# EAGLE design AnalogDiscoveryJacks (EAGLE 9.6.1)
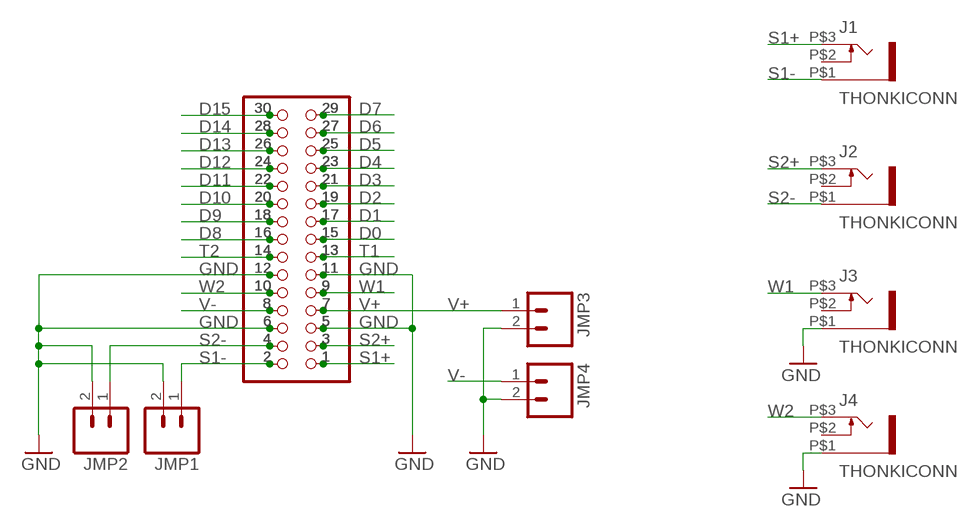
[diagram p0: schematic, sheet 1]

## Parts
J1  THONKICONN  [THONKICONN]
J2  THONKICONN  [THONKICONN]
J3  THONKICONN  [THONKICONN]
J4  THONKICONN  [THONKICONN]
JMP1  M02PTH  [1X02]
JMP2  M02PTH  [1X02]
JMP3  M02PTH  [1X02]
JMP4  M02PTH  [1X02]
JP1  PINHD-2X15  [2X15]
JP2  PINHD-2X15  [2X15]
JP3  PINHD-2X15  [2X15]

## Nets
D0: JP1.15 JP2.15 JP3.15
D1: JP1.17 JP2.17 JP3.17
D2: JP1.19 JP2.19 JP3.19
D3: JP1.21 JP2.21 JP3.21
D4: JP1.23 JP2.23 JP3.23
D5: JP1.25 JP2.25 JP3.25
D6: JP1.27 JP2.27 JP3.27
D7: JP1.29 JP2.29 JP3.29
D8: JP1.16 JP2.16 JP3.16
D9: JP1.18 JP2.18 JP3.18
D10: JP1.20 JP2.20 JP3.20
D11: JP1.22 JP2.22 JP3.22
D12: JP1.24 JP2.24 JP3.24
D13: JP1.26 JP2.26 JP3.26
D14: JP1.28 JP2.28 JP3.28
D15: JP1.30 JP2.30 JP3.30
GND: J3.P$1 J4.P$1 JMP1.2 JMP2.2 JMP3.2 JMP4.2 JP1.5 JP1.6 JP1.11 JP1.12 JP2.5 JP2.6 JP2.11 JP2.12 JP3.5 JP3.6 JP3.11 JP3.12
S1+: J1.P$3 JP1.1 JP2.1 JP3.1
S1-: J1.P$1 JMP1.1 JP1.2 JP2.2 JP3.2
S2+: J2.P$3 JP1.3 JP2.3 JP3.3
S2-: J2.P$1 JMP2.1 JP1.4 JP2.4 JP3.4
T1: JP1.13 JP2.13 JP3.13
T2: JP1.14 JP2.14 JP3.14
V+: JMP3.1 JP1.7 JP2.7 JP3.7
V-: JMP4.1 JP1.8 JP2.8 JP3.8
W1: J3.P$3 JP1.9 JP2.9 JP3.9
W2: J4.P$3 JP1.10 JP2.10 JP3.10
Unconnected: J1.P$2 J2.P$2 J3.P$2 J4.P$2

## Library data of the parts
J1-J4 = Rebel:THONKICONN
JMP1-JMP4 = SparkFun:M02: Header 2 Standard 2-pin 0.1" header. Use with straight break away headers (SKU : PRT-00116), right angle break away headers (PRT-00553), swiss pins (PRT-00743), machine pins (PRT-00117), and female headers (PRT-00115). Molex polarized connector foot print use with SKU : PRT-08233 with associated crimp pins and housings.
JP1-JP3 = pinhead:PINHD-2X15: PIN HEADER

## Board
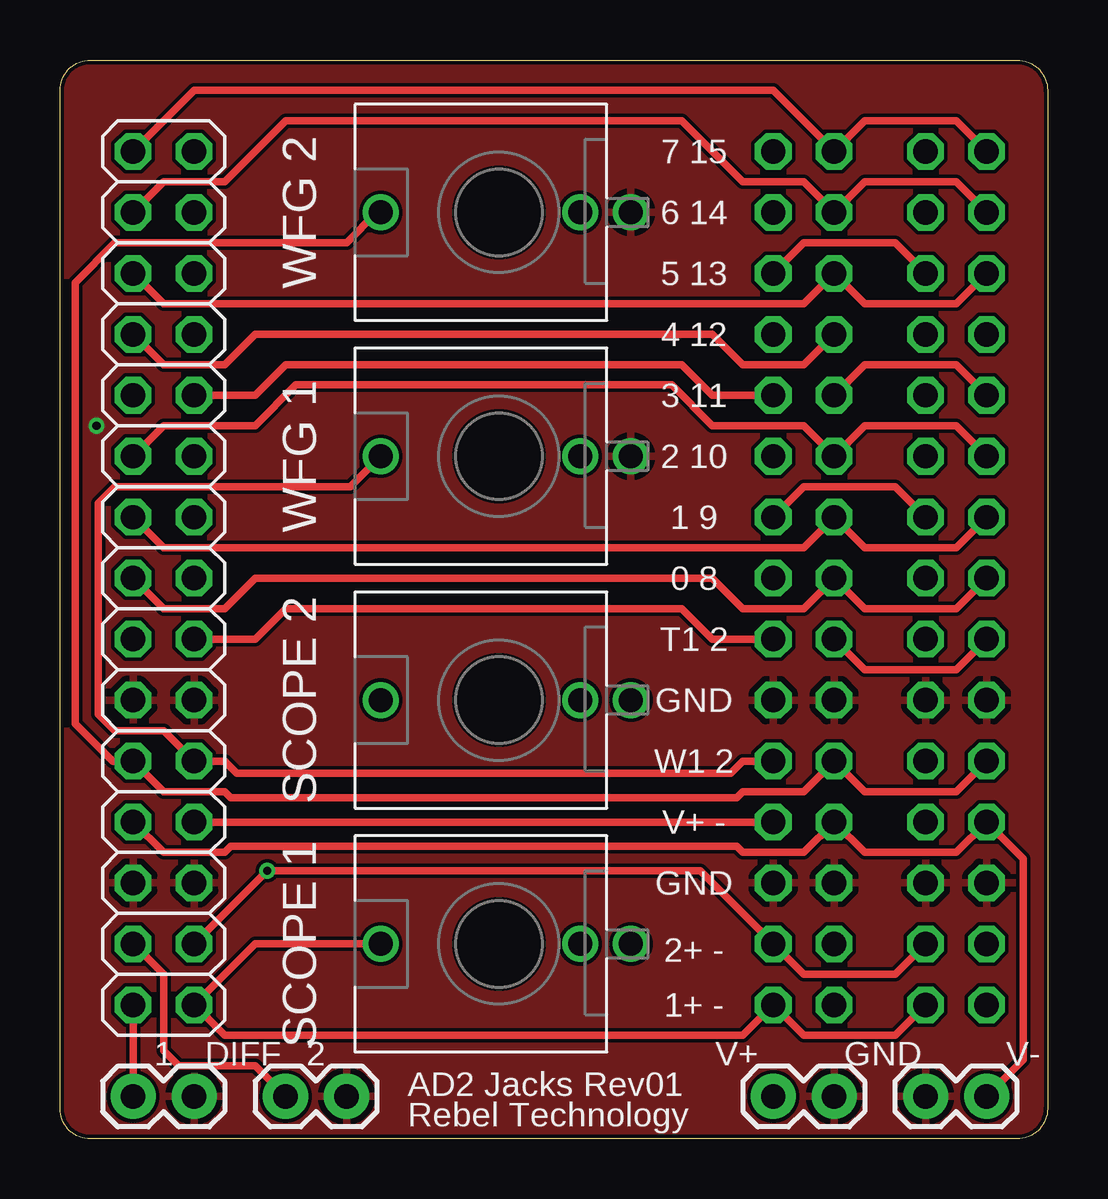
[diagram p1: board, top side]
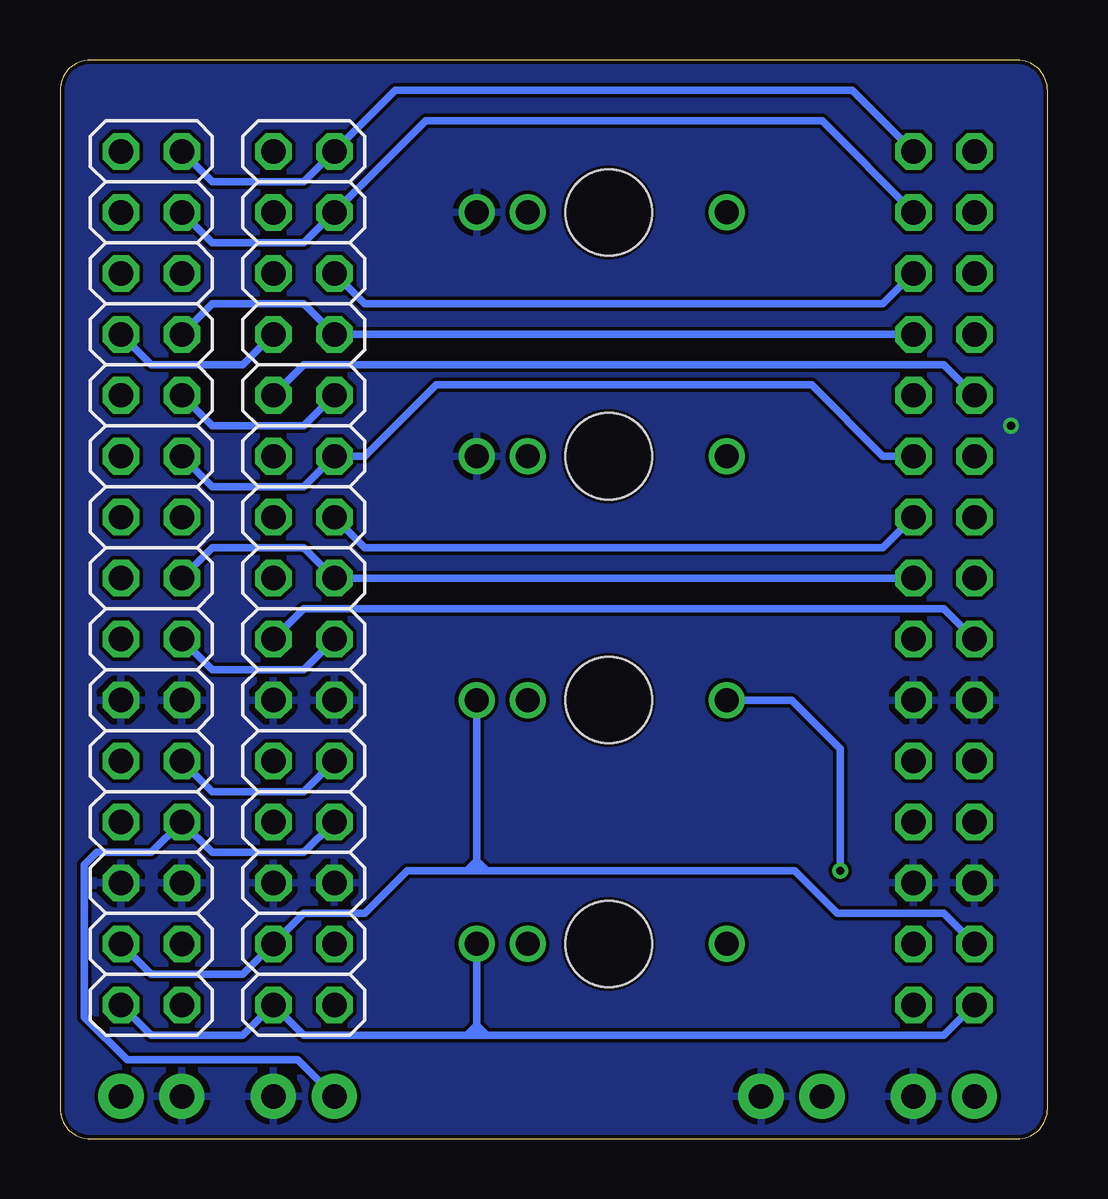
[diagram p2: board, bottom side, seen from below]

Size 41.15 x 44.96 mm. Coordinates in mm from the lower left corner, seen from the top.
Outline: 41.15,43.69 41.15,1.27 arc-90 39.88,0 1.27,0 arc-90 0,1.27 0,43.69 arc-90 1.27,44.96 39.88,44.96 arc-90 41.15,43.69
Copper layers (1*16): Top 0.035mm / dielectric 1.5mm / Bottom 0.035mm
Design rules "SparkFun-2-layer-PCBWay-LIMIT": minimum track width 6mil, minimum drill 0.3mm, track to track 6mil, track to pad 6mil, pad to pad 6mil, via to via 6mil, smd to smd 0mil, copper to edge 6mil, drill to drill 6mil, minimum pad ring 6mil, minimum via ring 6mil, stop-mask expansion 4mil, vias tented up to drill 25mil, thermal gap 10mil

### Footprints (pad centres in the part's own frame; a part is rotated, then mirrored left to right if it is on the bottom)
THONKICONN = drill 1: P$1 0,-5.5; P$2 0,-3.38; P$3 0,4.92 | hole 3.6: 0,0
1X02 = drill 1.016 pad 1.88: 1 0,0; 2 2.54,0
2X15 = drill 1.016 octagon: 1 -17.78,-1.27; 2 -17.78,1.27; 3 -15.24,-1.27; 4 -15.24,1.27; 5 -12.7,-1.27; 6 -12.7,1.27; 7 -10.16,-1.27; 8 -10.16,1.27; 9 -7.62,-1.27; 10 -7.62,1.27; 11 -5.08,-1.27; 12 -5.08,1.27; 13 -2.54,-1.27; 14 -2.54,1.27; 15 0,-1.27; 16 0,1.27; 17 2.54,-1.27; 18 2.54,1.27; 19 5.08,-1.27; 20 5.08,1.27; 21 7.62,-1.27; 22 7.62,1.27; 23 10.16,-1.27; 24 10.16,1.27; 25 12.7,-1.27; 26 12.7,1.27; 27 15.24,-1.27; 28 15.24,1.27; 29 17.78,-1.27; 30 17.78,1.27

### Placement (x,y rotation side)
J1  18.29,8.13 90 top
J2  18.29,18.29 90 top
J3  18.29,28.45 90 top
J4  18.29,38.61 90 top
JMP1  3.05,1.78 0 top
JMP2  9.4,1.78 0 top
JMP3  29.72,1.78 0 top
JMP4  38.61,1.78 180 top
JP1  4.32,23.37 90 top
JP2  30.99,23.37 90 bottom
JP3  37.34,23.37 90 bottom

### Tracks (layer width: path | path; a pad name or v marks a point on that pad's centre or on a via)
D0
  Bottom 0.305: JP1.15 JP2.15 30.99,24.64 34.8,24.64 JP3.15
D1
  Top 0.305: JP2.17 30.99,27.18 34.8,27.18 JP3.17
  Bottom 0.305: JP1.17 6.86,24.64 28.45,24.64 JP2.17
D2
  Bottom 0.305: JP1.19 6.86,28.45 9.83,31.42 25.48,31.42 28.45,28.45 JP2.19 30.99,27.18 34.8,27.18 JP3.19
D3
  Top 0.305: JP1.21 8.13,30.99 9.4,32.26 25.91,32.26 27.18,30.99 JP2.21
  Bottom 0.305: JP2.21 30.99,29.72 34.8,29.72 JP3.21
D4
  Bottom 0.305: JP1.23 JP2.23 30.99,34.8 34.8,34.8 JP3.23
D5
  Top 0.305: JP2.25 30.99,37.34 34.8,37.34 JP3.25
  Bottom 0.305: JP1.25 6.86,34.8 28.45,34.8 JP2.25
D6
  Bottom 0.305: JP1.27 9.4,42.42 25.91,42.42 JP2.27 30.99,37.34 34.8,37.34 JP3.27
D7
  Bottom 0.305: JP1.29 8.13,43.69 27.18,43.69 JP2.29 30.99,39.88 34.8,39.88 JP3.29
D8
  Top 0.305: JP1.16 4.32,22.1 6.86,22.1 8.13,23.37 27.18,23.37 28.45,22.1 30.99,22.1 JP2.16 33.53,22.1 37.34,22.1 JP3.16
D9
  Top 0.305: JP1.18 4.32,24.64 30.99,24.64 JP2.18 33.53,24.64 37.34,24.64 JP3.18
D10
  Top 0.305: JP1.20 4.32,29.72 8.13,29.72 9.83,31.42 25.48,31.42 27.18,29.72 30.99,29.72 JP2.20 33.53,29.72 37.34,29.72 JP3.20
D11
  Top 0.305: JP2.22 33.53,32.26 37.34,32.26 JP3.22
  Bottom 0.305: JP1.22 4.32,32.26 30.99,32.26 JP2.22
D12
  Top 0.305: JP1.24 4.32,32.26 6.86,32.26 8.13,33.53 27.18,33.53 28.45,32.26 30.99,32.26 JP2.24
  Bottom 0.305: JP2.24 33.53,32.26 37.34,32.26 JP3.24
D13
  Top 0.305: JP1.26 4.32,34.8 30.99,34.8 JP2.26 33.53,34.8 37.34,34.8 JP3.26
D14
  Top 0.305: JP1.28 4.32,39.88 6.86,39.88 9.4,42.42 25.91,42.42 28.45,39.88 30.99,39.88 JP2.28 33.53,39.88 37.34,39.88 JP3.28
D15
  Top 0.305: JP1.30 5.59,43.69 29.72,43.69 JP2.30 33.53,42.42 37.34,42.42 JP3.30
GND  (via drill 0.35)
  other vias: 1.52,29.72
  pour Bottom: -1.27,46.23 42.42,46.23 42.42,-0.76 -1.27,-0.76
  pour Top: -2.54,47.5 43.69,47.5 43.69,-2.03 -2.54,-2.03
S1+
  Top 0.305: J1.P$3 8.13,8.13 JP1.1 6.86,4.32 28.45,4.32 JP2.1 30.99,4.32 34.8,4.32 JP3.1
S1-
  Top 0.305: JP1.2 JMP1.1
  Bottom 0.305: JP1.2 4.32,4.32 23.37,4.32 | JP3.2 37.34,4.32 33.53,4.32 JP2.2 30.99,4.32 23.75,4.32 | 23.37,4.32 23.79,4.74 24.21,4.32 | 23.75,4.32 23.37,4.32 | J1.P$1 23.79,4.36 23.75,4.32
S2+  (via drill 0.35)
  Top 0.305: JP1.3 v8.64,11.18 23.37,11.18 26.67,11.18 JP2.3 30.99,6.86 34.8,6.86 JP3.3
  Bottom 0.305: J2.P$3 10.67,18.29 8.64,16.26 v8.64,11.18
S2-
  Top 0.305: JP1.4 4.32,6.86 4.32,3.68 4.95,3.05 8.13,3.05 JMP2.1
  Bottom 0.305: JP1.4 4.32,9.4 8.76,9.4 10.54,11.18 23.37,11.18 | JP3.4 37.34,6.86 33.53,6.86 JP2.4 30.99,9.4 28.45,9.4 26.67,11.18 24.21,11.18 | 23.37,11.18 23.79,11.6 24.21,11.18 | 24.21,11.18 23.75,11.18 | 23.75,11.18 23.37,11.18 | J2.P$1 23.79,11.22 23.75,11.18
T1
  Top 0.305: JP1.13 8.13,20.83 9.4,22.1 25.91,22.1 27.18,20.83 JP2.13
  Bottom 0.305: JP2.13 30.99,19.56 34.8,19.56 JP3.13
T2
  Top 0.305: JP2.14 33.53,19.56 37.34,19.56 JP3.14
  Bottom 0.305: JP1.14 4.32,22.1 30.99,22.1 JP2.14
V+
  Top 0.305: JP1.7 JP2.7
  Bottom 0.305: JP2.7 30.99,11.94 34.8,11.94 JP3.7 37.34,11.94 39.62,11.94 40.13,11.43 40.13,5.08 38.35,3.3 31.24,3.3 JMP3.1
V-
  Top 0.305: JP1.8 4.32,11.94 6.86,11.94 7.11,12.19 28.19,12.19 28.45,11.94 30.99,11.94 JP2.8 33.53,11.94 37.34,11.94 JP3.8 40.13,11.68 40.13,3.3 JMP4.1
W1
  Top 0.305: J3.P$3 12.1,27.18 2.29,27.18 1.6,26.49 1.6,17.7 2.29,17.02 4.32,17.02 JP1.9 6.86,15.75 7.37,15.24 27.94,15.24 28.45,15.75 JP2.9
  Bottom 0.305: JP2.9 30.99,14.48 34.8,14.48 JP3.9
W2
  Top 0.305: J4.P$3 13.21,38.61 11.94,37.34 2.29,37.34 0.63,35.69 0.63,17.31 2.2,15.75 JP1.10 4.32,14.48 6.86,14.48 7.11,14.22 28.19,14.22 28.45,14.48 30.99,14.48 JP2.10 33.53,14.48 37.34,14.48 JP3.10

### Text on the board
tPlace: 7 15 | WFG 2 | 6 14 | 5 13 | 4 12 | 3 11 | WFG 1 | 2 10 | 1 9 | 0 8 | T1 2 | SCOPE 2 | GND | W1 2 | V+ - | GND | SCOPE 1 | 2+ - | 1+ - | 1 | DIFF | 2 | V+ | GND | V- | AD2 Jacks Rev01 | Rebel Technology